# EAGLE design CANnibal (EAGLE 9.2.2)
Therm
CNAME: CANnibal USB; CREVISION: 0.9; DESIGNER: psyte
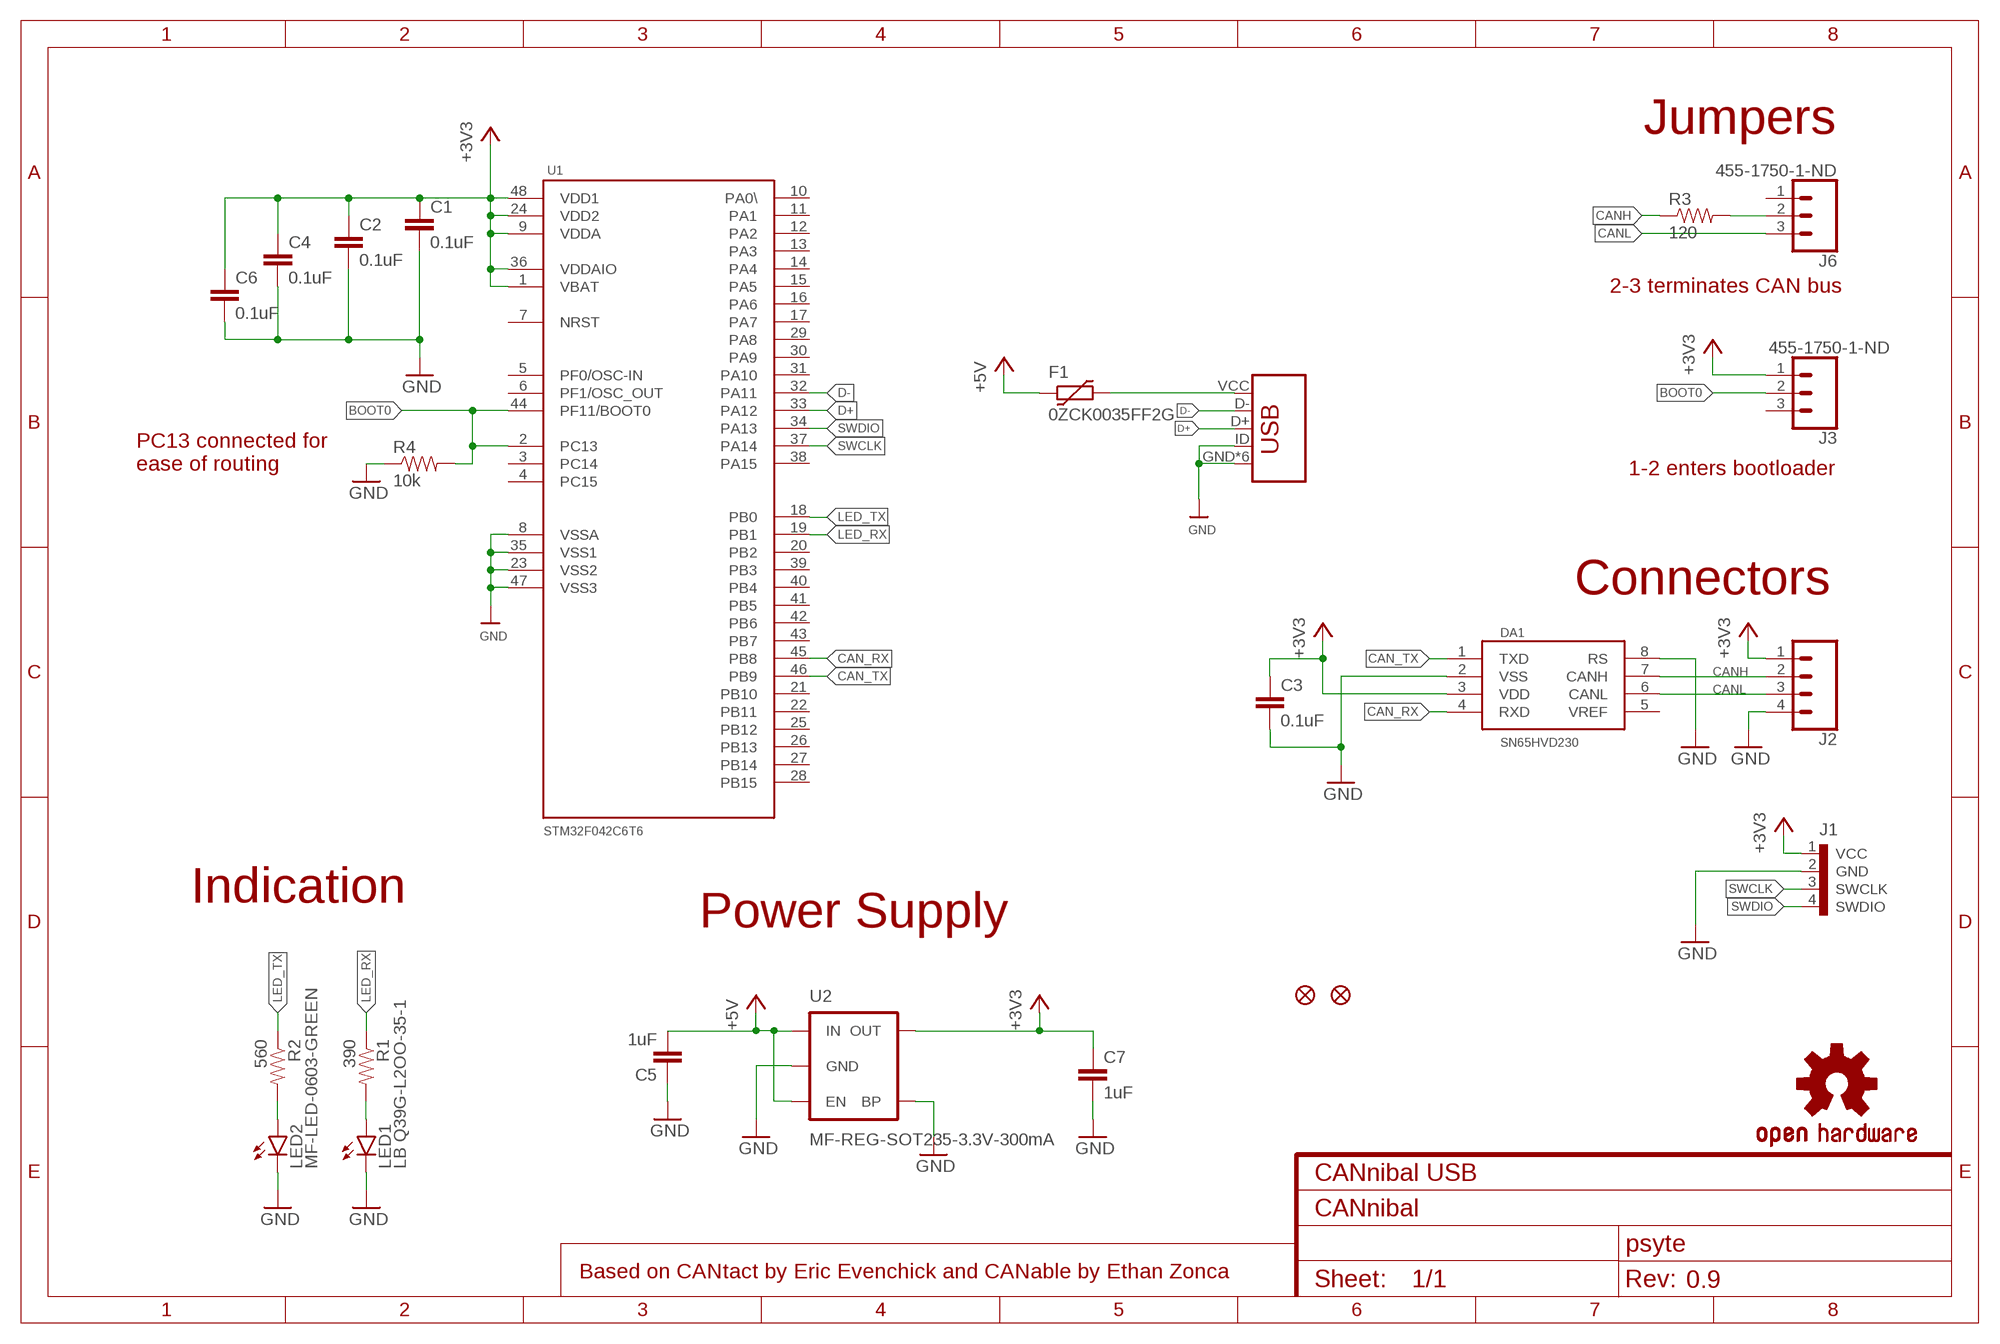
[diagram p0: schematic, sheet 1]

## Parts
C1  0.1uF  CAP0603-CAP  [0603-CAP]
C2  0.1uF  CAP0603-CAP  [0603-CAP]
C3  0.1uF  CAP0603-CAP  [0603-CAP]
C4  0.1uF  CAP0603-CAP  [0603-CAP]
C5  1uF  CAP0603-CAP  [0603-CAP]
C6  0.1uF  CAP0603-CAP  [0603-CAP]
C7  1uF  CAP0603-CAP  [0603-CAP]
DA1  SN65HVD230  [SO08]
F1  0ZCK0035FF2G  FUSE_PTC-0805  [PTC0805]
FD1  FIDUCIAL1X2  [FIDUCIAL-1X2]
FD2  FIDUCIAL1X2  [FIDUCIAL-1X2]
J1  POGOPIN-CONN-4  [POGOPROG-CONN-4-ALLSMT]
J2  CONN_04  [1X04]
J3  455-1750-1-ND  CONN_03  [1X03]
J6  455-1750-1-ND  CONN_03  [1X03]
LED1  LB Q39G-L2OO-35-1  LED0603  [LED-0603]
LED2  MF-LED-0603-GREEN  LED0603  [LED-0603]
LOGO1  OSHW-LOGOS  [OSHW-LOGO-S]
R1  390  RESISTOR0603-RES  [0603-RES]
R2  560  RESISTOR0603-RES  [0603-RES]
R3  120  RESISTOR0603-RES  [0603-RES]
R4  10k  RESISTOR0603-RES  [0603-RES]
U1  STM32F042C6T6  [LQFP48]
U2  MF-REG-SOT235-3.3V-300mA  MIC52053.3V  [SOT23-5]
U$4  MICRO-USB-B  [MICRO_USB_4_LEGS]

## Nets
+3V3: C1.1 C2.1 C3.1 C4.1 C6.1 C7.1 DA1.3(VDD) J1.1(VCC) J2.1 J3.1 U1.1(VBAT) U1.9(VDDA) U1.24(VDD2) U1.36(VDDAIO) U1.48(VDD1) U2.5(OUT)
+5V: C5.2 F1.1 U2.1(IN) U2.3(EN)
BOOT0: J3.2 R4.2 U1.2(PC13) U1.44(PF11/BOOT0)
CAN_RX: DA1.4(RXD) U1.45(PB8)
CAN_TX: DA1.1(TXD) U1.46(PB9)
CANH: DA1.7(CANH) J2.2 R3.1
CANL: DA1.6(CANL) J2.3 J6.3
D+: U1.33(PA12) U$4.D+
D-: U1.32(PA11) U$4.D-
GND: C1.2 C2.2 C3.2 C4.2 C5.1 C6.2 C7.2 DA1.2(VSS) DA1.8(RS) J1.2(GND) J2.4 LED1.C LED2.C R4.1 U1.8(VSSA) U1.23(VSS2) U1.35(VSS1) U1.47(VSS3) U2.2(GND) U2.4(BP) U$4.GND U$4.ID U$4.P$1(GND) U$4.P$2(GND) U$4.P$3(GND) U$4.P$4(GND) U$4.P$5(GND)
LED_RX: R1.1 U1.19(PB1)
LED_TX: R2.1 U1.18(PB0)
N$2: LED2.A R2.2
N$3: J6.2 R3.2
N$23: LED1.A R1.2
SWCLK: J1.3(SWCLK) U1.37(PA14)
SWDIO: J1.4(SWDIO) U1.34(PA13)
VBUS_RAW: F1.2 U$4.VCC(VBUS)
Unconnected: DA1.5(VREF) J3.3 J6.1 U1.3(PC14) U1.4(PC15) U1.5(PF0/OSC-IN) U1.6(PF1/OSC_OUT) U1.7(NRST) U1.10(PA0\) U1.11(PA1) U1.12(PA2) U1.13(PA3) U1.14(PA4) U1.15(PA5) U1.16(PA6) U1.17(PA7) U1.20(PB2) U1.21(PB10) U1.22(PB11) U1.25(PB12) U1.26(PB13) U1.27(PB14) U1.28(PB15) U1.29(PA8) U1.30(PA9) U1.31(PA10) U1.38(PA15) U1.39(PB3) U1.40(PB4) U1.41(PB5) U1.42(PB6) U1.43(PB7)

## Notes on the sheet
- Jumpers
- 2-3 terminates CAN bus
- 1-2 enters bootloader
- PC13 connected for
  ease of routing
- Connectors
- Indication
- Power Supply
- Based on CANtact by Eric Evenchick and CANable by Ethan Zonca

## Library data of the parts
C1-C7 = SparkFun-Passives:CAP: Capacitor Standard 0603 ceramic capacitor, and 0.1" leaded capacitor.
DA1 = can_driver:SN65HVD230: CAN PHY driver 3.3-V CAN TRANSCEIVERS
F1 = dp_devices:FUSE_PTC: Resettable PTC
FD1 FD2 = SparkFun-Aesthetics:FIDUCIAL: Fiducial Alignment Points Point-of-reference for pick-and-place machines and other optical instruments.
J1 = Protofusion:POGOPIN-CONN-4
J2 = SparkFun-Connectors:CONN_04: Multi connection point. Often used as Generic Header-pin footprint for 0.1 inch spaced/style header connections On any of the 0.1 inch spaced packages, you can populate with these: Break Away Headers - Straight <https://www.sparkfun.com/products/116> (PRT-00116) Break Away Male Headers - Right Angle <https://www.sparkfun.com/products/553> (PRT-00553) Female Headers <https://www.sparkfun.com/products/115> (PRT-00115) Break Away Headers - Machine Pin <https://www.sparkfun.com/products/117> (PRT-00117) Break Away Female Headers - Swiss Machine Pin <https://www.sparkfun.com/products/743> (PRT-00743) For SCREWTERMINALS and SPRING TERMINALS visit here: Screw Terimnals on SparkFun.com <https://www.sparkfun.com/search/results?term=Screw+Terminals> (5mm/3.5mm/2.54mm spacing) This device is also useful as a general connection point to wire up your design to another part of your project. Our various solder wires solder well into these plated through hole pads. Hook-Up Wire - Assortment (Stranded, 22 AWG) <https://www.sparkfun.com/products/11375> (PRT-11375) Hook-Up Wire - Assortment (Solid Core, 22 AWG) <https://www.sparkfun.com/products/11367> (PRT-11367) View the entire wire category on our website here <https://www.sparkfun.com/categories/141> Special notes: Molex polarized connector foot print use with SKU : PRT-08231 with associated crimp pins and housings. 1MM SMD Version SKU: PRT-10208; PROD_ID: CONN-09696
J3 J6 = SparkFun-Connectors:CONN_03: Multi connection point. Often used as Generic Header-pin footprint for 0.1 inch spaced/style header connections On any of the 0.1 inch spaced packages, you can populate with these: Break Away Headers - Straight <https://www.sparkfun.com/products/116> (PRT-00116) Break Away Male Headers - Right Angle <https://www.sparkfun.com/products/553> (PRT-00553) Female Headers <https://www.sparkfun.com/products/115> (PRT-00115) Break Away Headers - Machine Pin <https://www.sparkfun.com/products/117> (PRT-00117) Break Away Female Headers - Swiss Machine Pin <https://www.sparkfun.com/products/743> (PRT-00743) Stackable Header - 3 Pin (Female, 0.1") <https://www.sparkfun.com/products/13875> (PRT-13875) For SCREWTERMINALS and SPRING TERMINALS visit here: Screw Terimnals on SparkFun.com <https://www.sparkfun.com/search/results?term=Screw+Terminals> (5mm/3.5mm/2.54mm spacing) This device is also useful as a general connection point to wire up your design to another part of your project. Our various solder wires solder well into these plated through hole pads. Hook-Up Wire - Assortment (Stranded, 22 AWG) <https://www.sparkfun.com/products/11375> (PRT-11375) Hook-Up Wire - Assortment (Solid Core, 22 AWG) <https://www.sparkfun.com/products/11367> (PRT-11367) View the entire wire category on our website here <https://www.sparkfun.com/categories/141> Special notes: Molex polarized connector foot print use with SKU : PRT-08232 with associated crimp pins and housings.; PROD_ID: XXX-00000
LED1 LED2 = SparkFun-LED:LED: LED (Generic) Standard schematic elements and footprints for 5mm, 3mm, 1206, and 0603 sized LEDs. Generic LEDs with no color specified.
LOGO1 = SparkFun-Aesthetics:OSHW-LOGO: Open-Source Hardware (OSHW) Logo This logo indicates the piece of hardware it is found on incorporates a OSHW license and/or adheres to the definition of open source hardware found here: http://freedomdefined.org/OSHW
R1-R4 = SparkFun-Passives:RESISTOR: Resistor Basic schematic elements and footprints for 0603, 1206, and PTH resistors.
U1 = Protofusion:STM32F042C6T6
U2 = SparkFun-PowerIC:MIC5205: MIC5205 150mA vreg 3.3V - VREG-00822 5V - VREG-00823; PROD_ID: VREG-00822
U$4 = pmc_lib:MICRO-USB-B

## Board
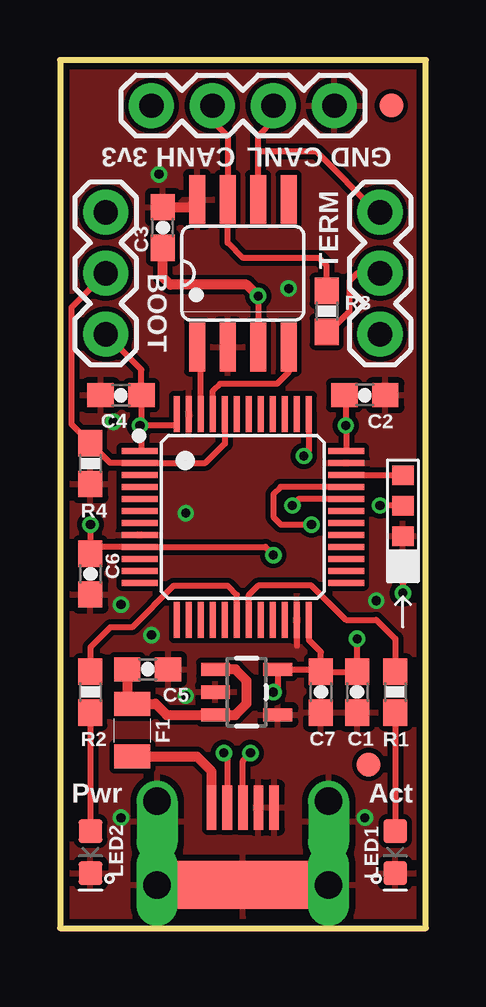
[diagram p1: board, top side]
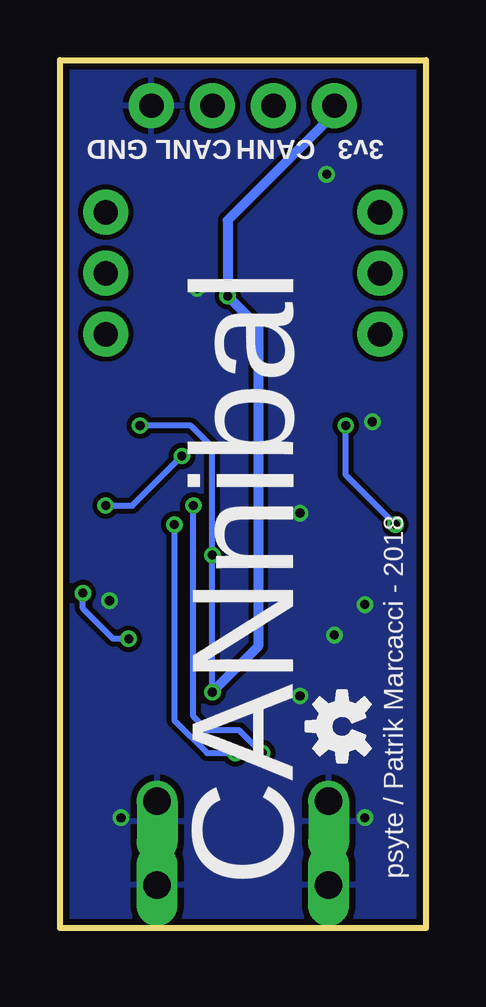
[diagram p2: board, bottom side, seen from below]

Size 15.24 x 36.2 mm. Coordinates in mm from the lower left corner, seen from the top.
Outline: 15.24,0 15.24,36.2 0,36.2 0,0 15.24,0
Copper layers (1*16): Top 0.035mm / dielectric 1.5mm / Bottom 0.035mm
Design rules "Elecrow_2-layer_eagle_rule *": minimum track width 6mil, minimum drill 12mil, track to track 8mil, track to pad 8mil, pad to pad 8mil, via to via 8mil, smd to smd 0mil, copper to edge 10mil, drill to drill 10mil, minimum pad ring 10mil, minimum via ring 6mil, stop-mask expansion 1mil, vias tented up to drill 16mil, thermal gap 10mil

### Footprints (pad centres in the part's own frame; a part is rotated, then mirrored left to right if it is on the bottom)
0603-CAP = smd 1.1 x 1: 1 -0.85,0; 2 0.85,0
SO08 = smd 0.66 x 2.032: 1 -1.905,-3.073; 2 -0.635,-3.073; 3 0.635,-3.073; 4 1.905,-3.073; 5 1.905,3.073; 6 0.635,3.073; 7 -0.635,3.073; 8 -1.905,3.073
PTC0805 = smd 1 x 1.5: 1 -1.1,0; 2 1.1,0
FIDUCIAL-1X2 = smd 1 x 1: 1 0,0
POGOPROG-CONN-4-ALLSMT = smd 0.889 x 0.813: 1 0,1.27; 2 0,0; 3 0,-1.27; 4 0,-2.54
1X04 = drill 1.016 pad 1.88: 1 0,0; 2 2.54,0; 3 5.08,0; 4 7.62,0
1X03 = drill 1.016 pad 1.88: 1 0,0; 2 2.54,0; 3 5.08,0
LED-0603 = smd 1 x 1: A -0.877,0; C 0.877,0
0603-RES = smd 1.1 x 1: 1 -0.85,0; 2 0.85,0
LQFP48 = smd 1.5 x 0.25: 1 -4.3,2.75; 2 -4.3,2.25; 3 -4.3,1.75; 4 -4.3,1.25; 5 -4.3,0.75; 6 -4.3,0.25; 7 -4.3,-0.25; 8 -4.3,-0.75; 9 -4.3,-1.25; 10 -4.3,-1.75; 11 -4.3,-2.25; 12 -4.3,-2.75; 25 4.3,-2.75; 26 4.3,-2.25; 27 4.3,-1.75; 28 4.3,-1.25; 29 4.3,-0.75; 30 4.3,-0.25; 31 4.3,0.25; 32 4.3,0.75; 33 4.3,1.25; 34 4.3,1.75; 35 4.3,2.25; 36 4.3,2.75 | smd 0.25 x 1.5: 13 -2.75,-4.3; 14 -2.25,-4.3; 15 -1.75,-4.3; 16 -1.25,-4.3; 17 -0.75,-4.3; 18 -0.25,-4.3; 19 0.25,-4.3; 20 0.75,-4.3; 21 1.25,-4.3; 22 1.75,-4.3; 23 2.25,-4.3; 24 2.75,-4.3; 37 2.75,4.3; 38 2.25,4.3; 39 1.75,4.3; 40 1.25,4.3; 41 0.75,4.3; 42 0.25,4.3; 43 -0.25,4.3; 44 -0.75,4.3; 45 -1.25,4.3; 46 -1.75,4.3; 47 -2.25,4.3; 48 -2.75,4.3
SOT23-5 = smd 0.55 x 1.2: 1 -0.95,-1.3; 2 0,-1.3; 3 0.95,-1.3; 4 0.95,1.3; 5 -0.95,1.3
MICRO_USB_4_LEGS = smd 1.85 x 0.4: D+ 3.125,0; D- 3.125,0.65; GND 3.125,-1.3; ID 3.125,-0.65; VCC 3.125,1.3 | drill 1.143 pad 1.524 long: P$1 -0.1,3.575; P$2 -0.1,-3.575 | drill 1.143 pad 1.524 offset: P$3 3.4,3.575; P$5 3.4,-3.575 | smd 2 x 6: P$4 -0.1,0

### Placement (x,y rotation side)
C1  12.38,9.84 270 top
C2  12.7,22.23 0 top
C3  4.29,29.21 90 top
C4  2.54,22.23 180 top
C5  3.65,10.79 180 top
C6  1.27,14.76 270 top
C7  10.87,9.84 270 top
DA1  7.62,27.3 0 top
F1  3.02,8.26 270 top
FD1  13.81,34.29 0 top
FD2  12.86,6.83 0 top
J1  14.29,16.35 180 top
J2  3.81,34.29 0 top
J3  1.91,24.77 90 top
J6  13.34,24.77 90 top
LED1  13.97,3.17 270 top
LED2  1.27,3.17 270 top
LOGO1  3.49,8.41 90 bottom
R1  13.97,9.84 270 top
R2  1.27,9.84 270 top
R3  11.11,25.72 270 top
R4  1.27,19.37 90 top
U1  7.62,17.14 0 top
U2  7.78,9.84 270 top
U$4  7.62,1.91 90 top

### Tracks (layer width: path | path; a pad name or v marks a point on that pad's centre or on a via)
+3V3  (via drill 0.38)
  Top 0.254: v8.89,9.84 9.08,10.03 U2.5 10.77,10.79 C7.1 | v1.27,16.83 C6.1 1.55,15.89 U1.9 8.55,15.89 v8.89,15.56 | 3.39,20.95 C4.1 3.39,23.28 J3.1 | 3.39,20.95 3.39,19.96 U1.1 | U1.48 4.87,21.01 4.82,20.95 v3.33,20.95 3.39,20.95 | v11.91,20.95 v11.92,20.95 | v11.92,20.95 U1.36 | v11.92,20.95 11.92,22.16 C2.1 | J1.1 v14.29,13.97 | U1.24 10.37,12.01 10.87,11.51 C7.1 | v12.38,12.06 C1.1 C7.1 | v8.26,26.35 DA1.3
  Top 0.406: v8.26,26.35 7.78,26.83 4.6,26.83 4.29,27.15 C3.1
  Bottom 0.254: v11.91,20.95 9.79,20.95 8.89,20.06 v8.89,15.56 v8.89,9.84 | v1.27,16.83 3.33,18.89 v3.33,20.95 | v12.38,12.06 13.02,12.06 14.29,13.34 v14.29,13.97
  Bottom 0.406: J2.1 3.81,33.95 8.26,29.51 v8.26,26.35 6.99,25.08 6.99,11.75 v8.89,9.84
+5V
  Top 0.406: C5.2 2.8,9.57 F1.1 3.98,9.36 4.45,8.89 U2.3 7.3,8.89 7.78,9.37 7.78,10.32 7.3,10.79 U2.1
BOOT0
  Top 0.254: U1.44 6.87,20.2 6.06,19.39 U1.2 2.09,19.39 R4.2 0.48,21.01 0.48,25.88 J3.2
CAN_RX
  Top 0.254: U1.45 6.37,22.4 6.67,22.7 9.05,22.7 9.53,23.18 DA1.4
CAN_TX
  Top 0.254: U1.46 5.87,24.08 DA1.1
CANH
  Top 0.254: R3.1 11.11,27.62 10.79,27.94 7.62,27.94 6.99,28.57 DA1.7 6.99,33.02 6.35,33.66 J2.2
CANL
  Top 0.254: 8.26,32.38 10.67,32.38 13.21,29.84 J6.3 | J2.3 8.89,33.66 8.26,33.02 8.26,32.38 | DA1.6 8.26,32.38
D+  (via drill 0.38)
  Top 0.254: U1.33 9.19,18.39 8.89,18.1 8.89,17.14 9.21,16.83 v10.48,16.83 | v7.94,7.3 7.62,6.99 U$4.D+
  Bottom 0.254: v10.48,16.83 10.48,8.67 9.11,7.3 v7.94,7.3
D-  (via drill 0.38)
  Top 0.254: U1.32 9.96,17.89 v9.68,17.62 | 6.97,7.16 U$4.D-
  Top 0.305: 6.97,7.16 v6.83,7.3
  Bottom 0.254: v9.68,17.62 9.68,8.83 9.11,8.26 7.78,8.26 v6.83,7.3
GND  (via drill 0.38)
  Top 0.254: U1.23 9.87,11.78
  Top 0.406: C3.2 5.4,30.06 DA1.8
  other vias: 12.7,4.6 2.54,4.6 9.53,26.67 2.22,21.11 3.81,12.22 5.24,9.68 2.54,13.49 13.18,13.65 5.24,17.3 4.13,31.43
  pour Bottom: 0,36.2 15.24,36.2 15.24,0 0,0
  pour Top: 0,0 15.24,0 15.24,36.2 0,36.2
LED_RX
  Top 0.254: U1.19 7.87,13.9 8.26,14.29 10.48,14.29 11.91,12.86 13.18,12.86 13.97,12.06 R1.1
LED_TX
  Top 0.254: U1.18 7.37,13.9 6.99,14.29 4.75,14.29 3,12.54 2.1,12.54 1.27,11.71 R2.1
N$1
  cutout Top: 4.45,29.84 5.08,30.48 4.45,30.48
N$2
  Top 0.254: R2.2 LED2.A
N$3
  Top 0.254: R3.2 11.21,24.87 12.06,25.72 12.06,26.99 12.38,27.3 J6.2
N$23
  Top 0.254: R1.2 LED1.A
SWCLK  (via drill 0.38)
  Top 0.254: U1.37 10.37,19.89 v10.16,19.68 | J1.3 v13.34,17.62
  Bottom 0.254: v13.34,17.62 12.22,17.62 v10.16,19.68
SWDIO
  Top 0.254: U1.34 J1.4
VBUS_RAW
  Top 0.305: 5.79,7.06 5.7,7.16
  Top 0.406: F1.2 5.7,7.16 | 5.79,7.06 6.32,6.54 U$4.VCC

### Text on the board
tPlace: 3v3 | CANH | CANL | GND | BOOT | TERM | Pwr | Act
bPlace: 3v3 | CANH | CANL | GND | psyte / Patrik Marcacci - 2018 | CANnibal